# Altium project MAIN_BORAD.PrjPcb
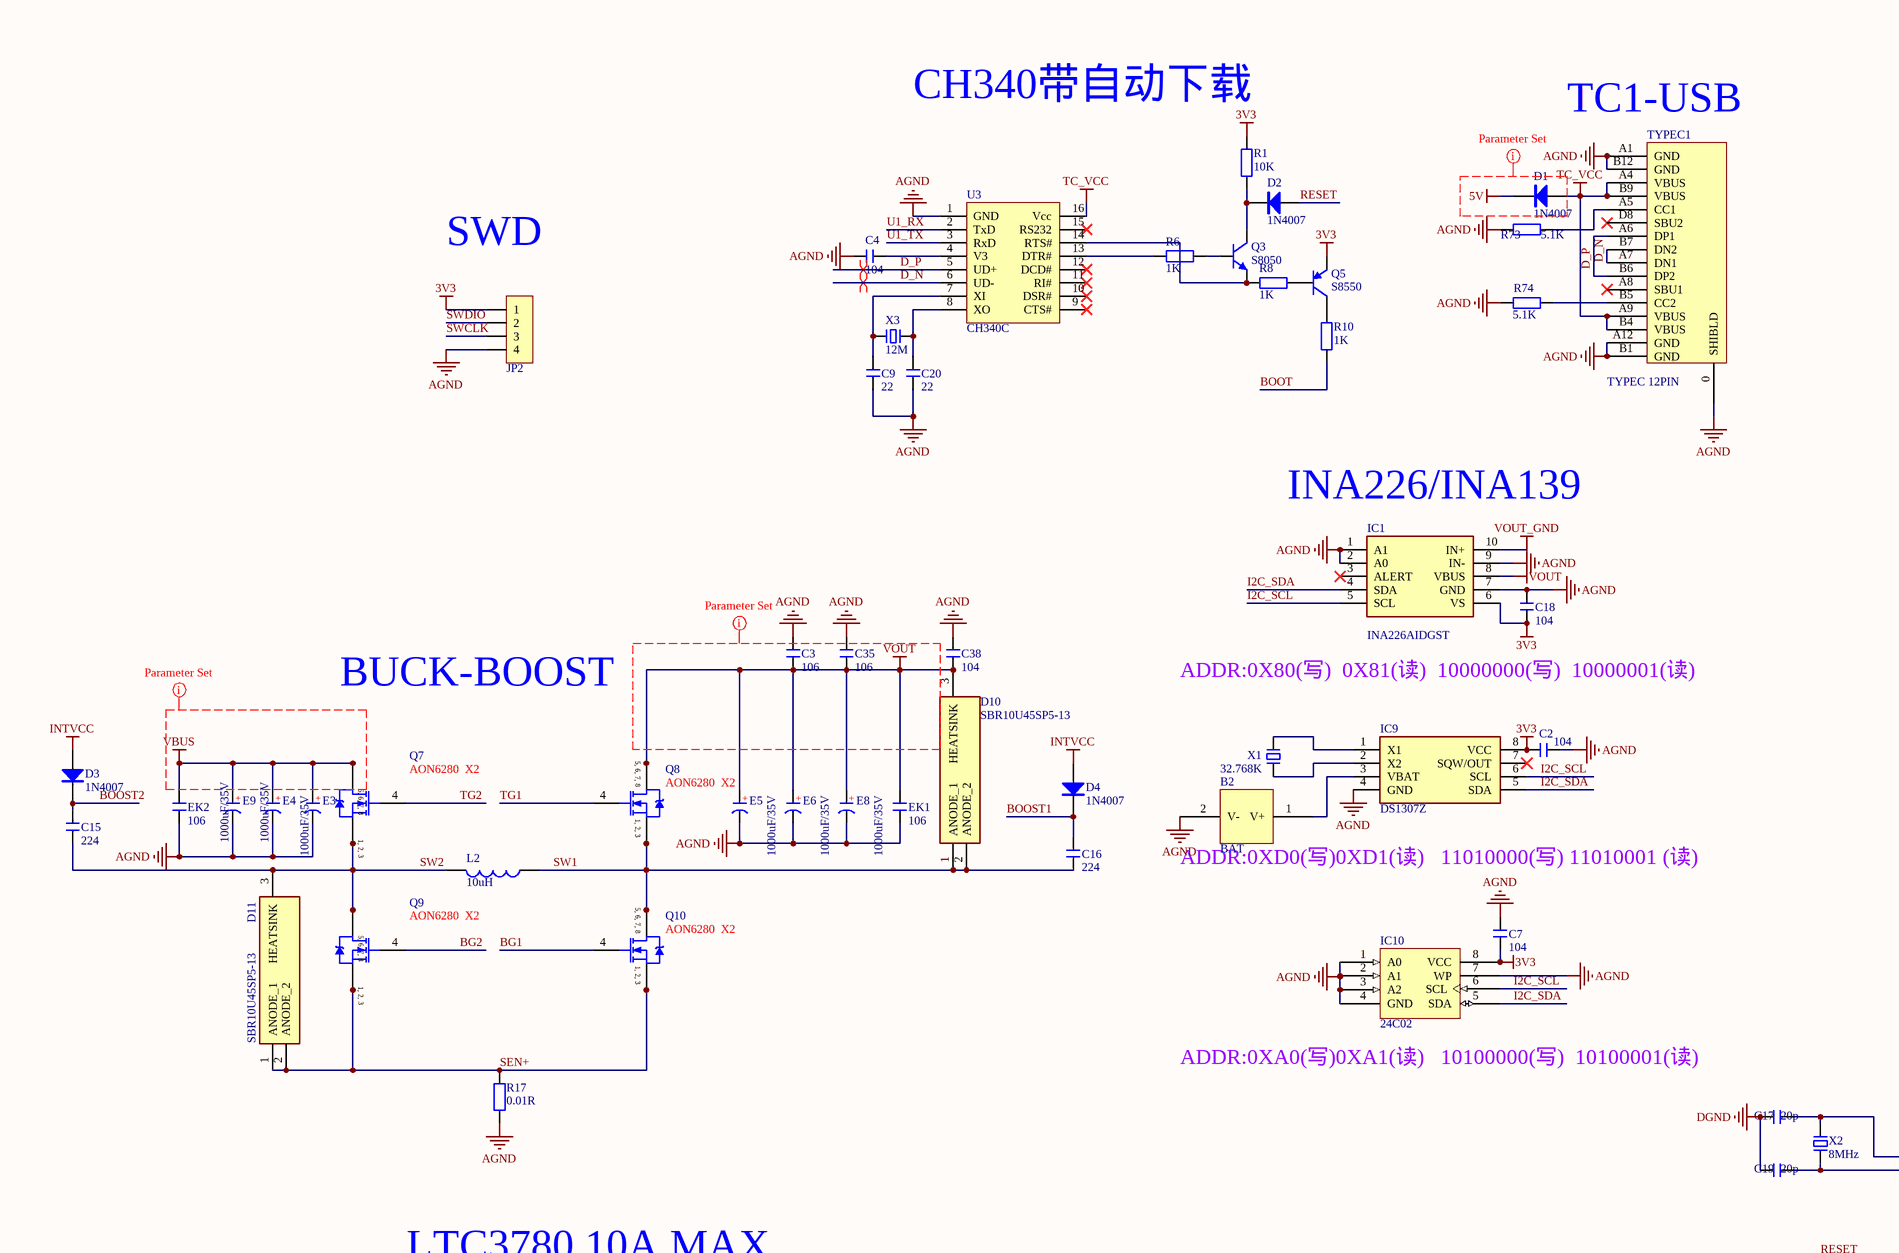
[diagram p0: MAIN_BORAD.SchDoc, top left]
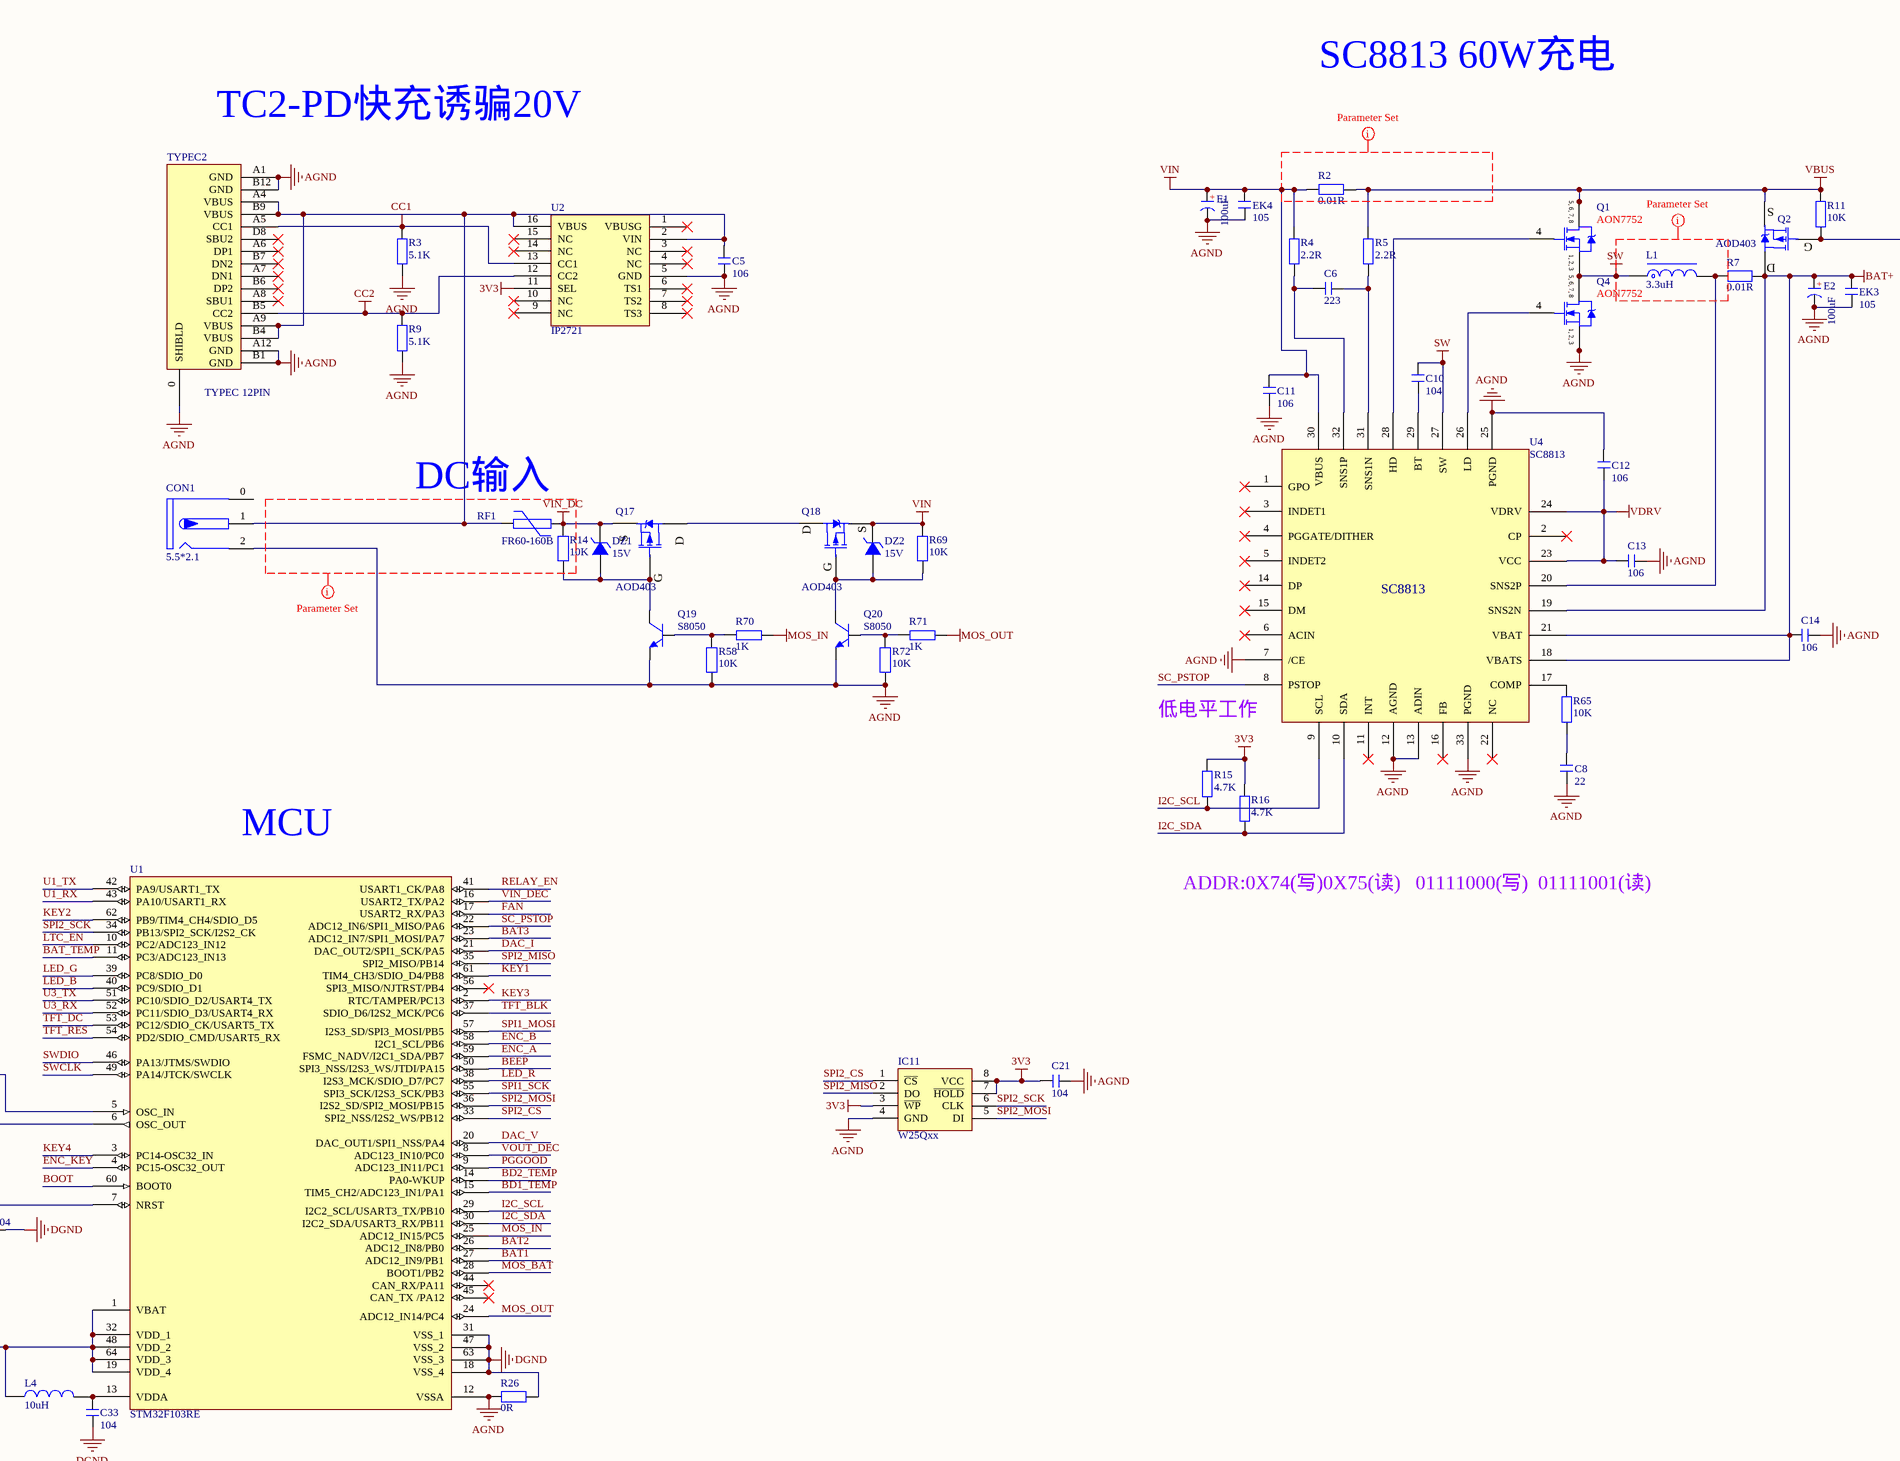
[diagram p1: MAIN_BORAD.SchDoc, top middle]
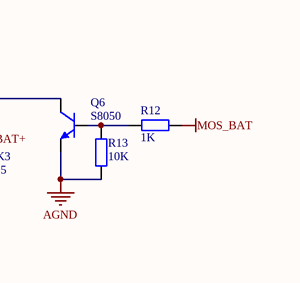
[diagram p2: MAIN_BORAD.SchDoc, top right]
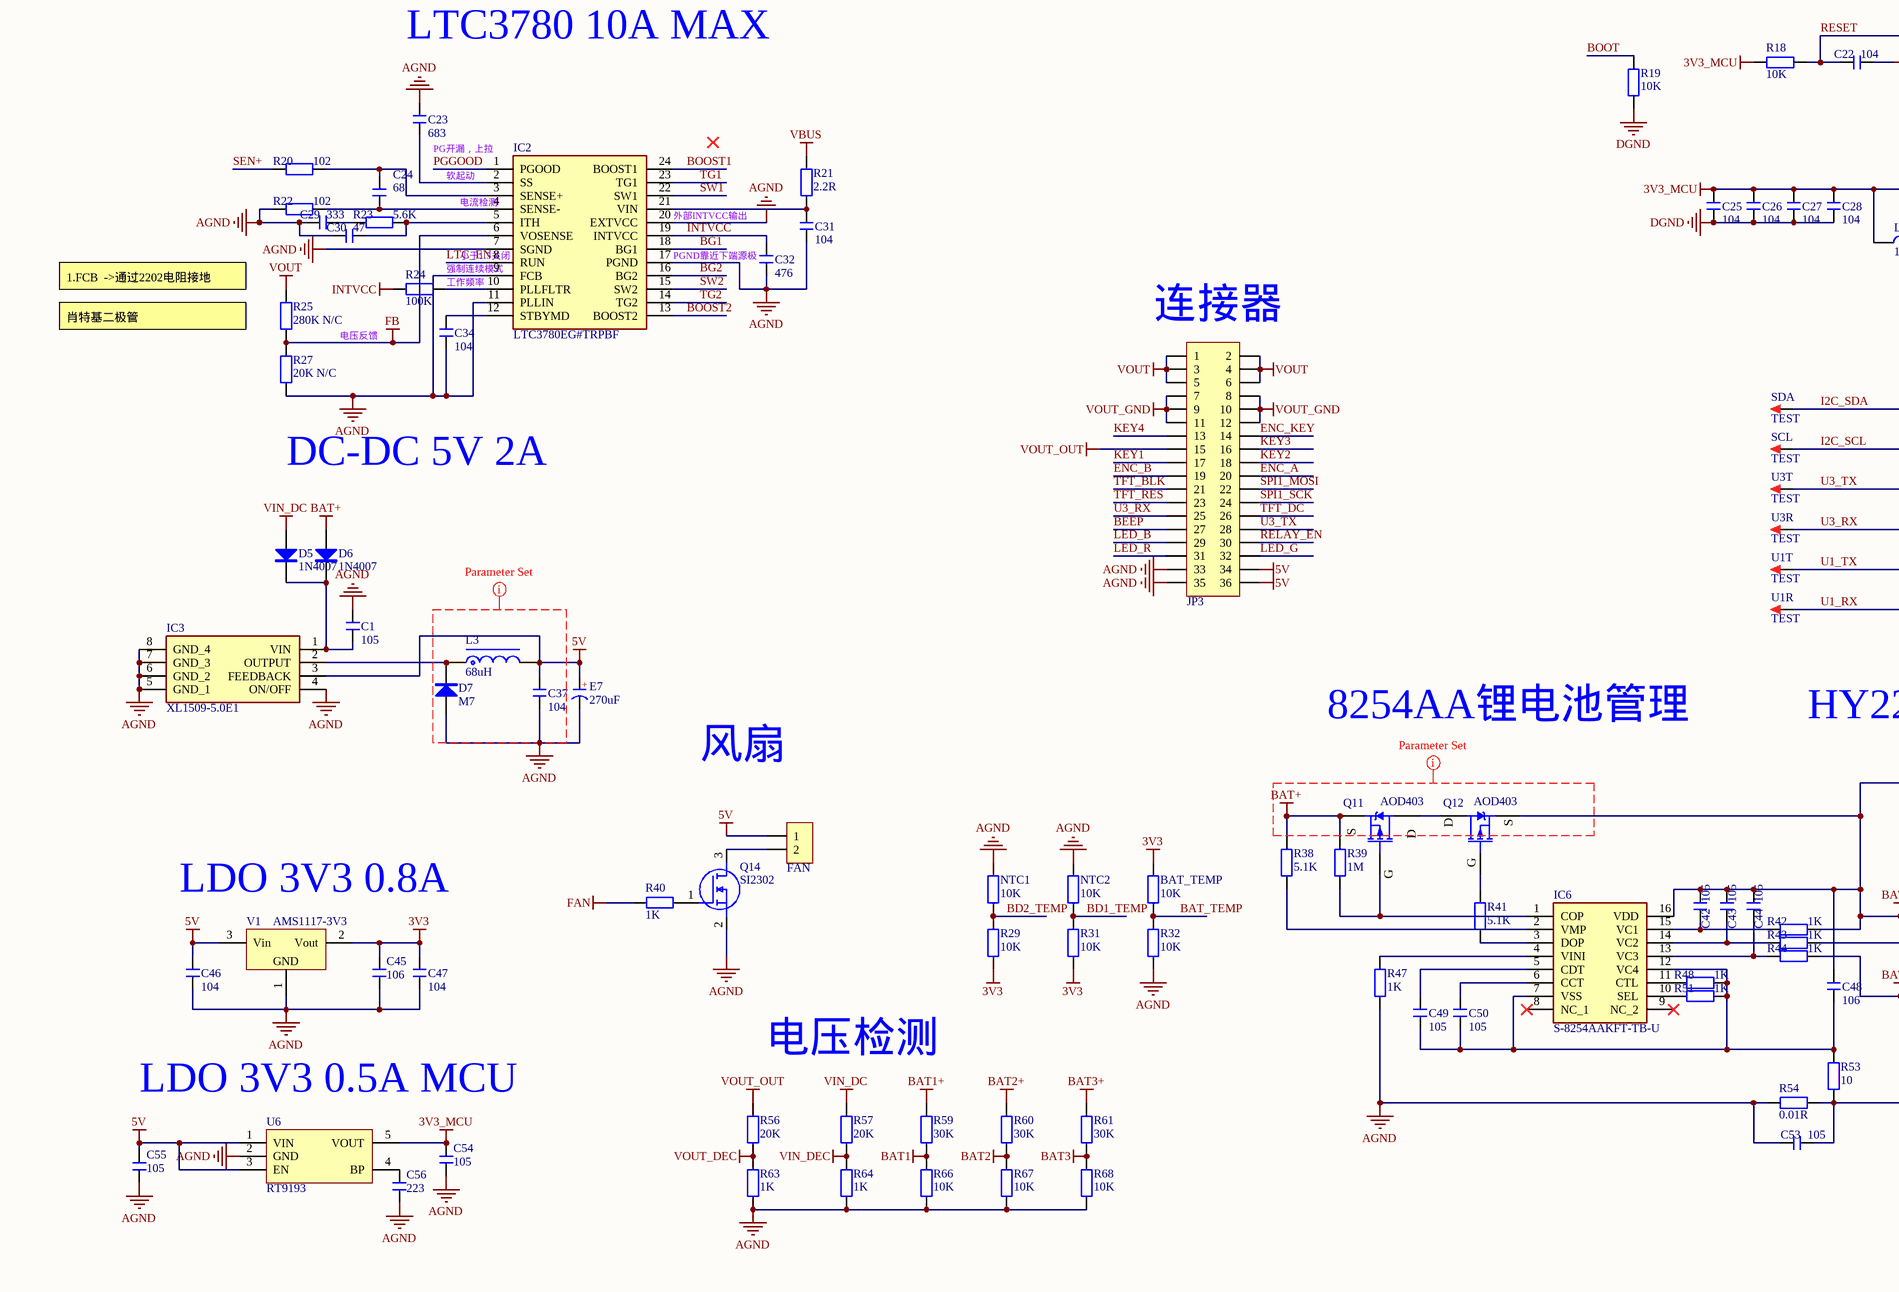
[diagram p3: MAIN_BORAD.SchDoc, bottom left]
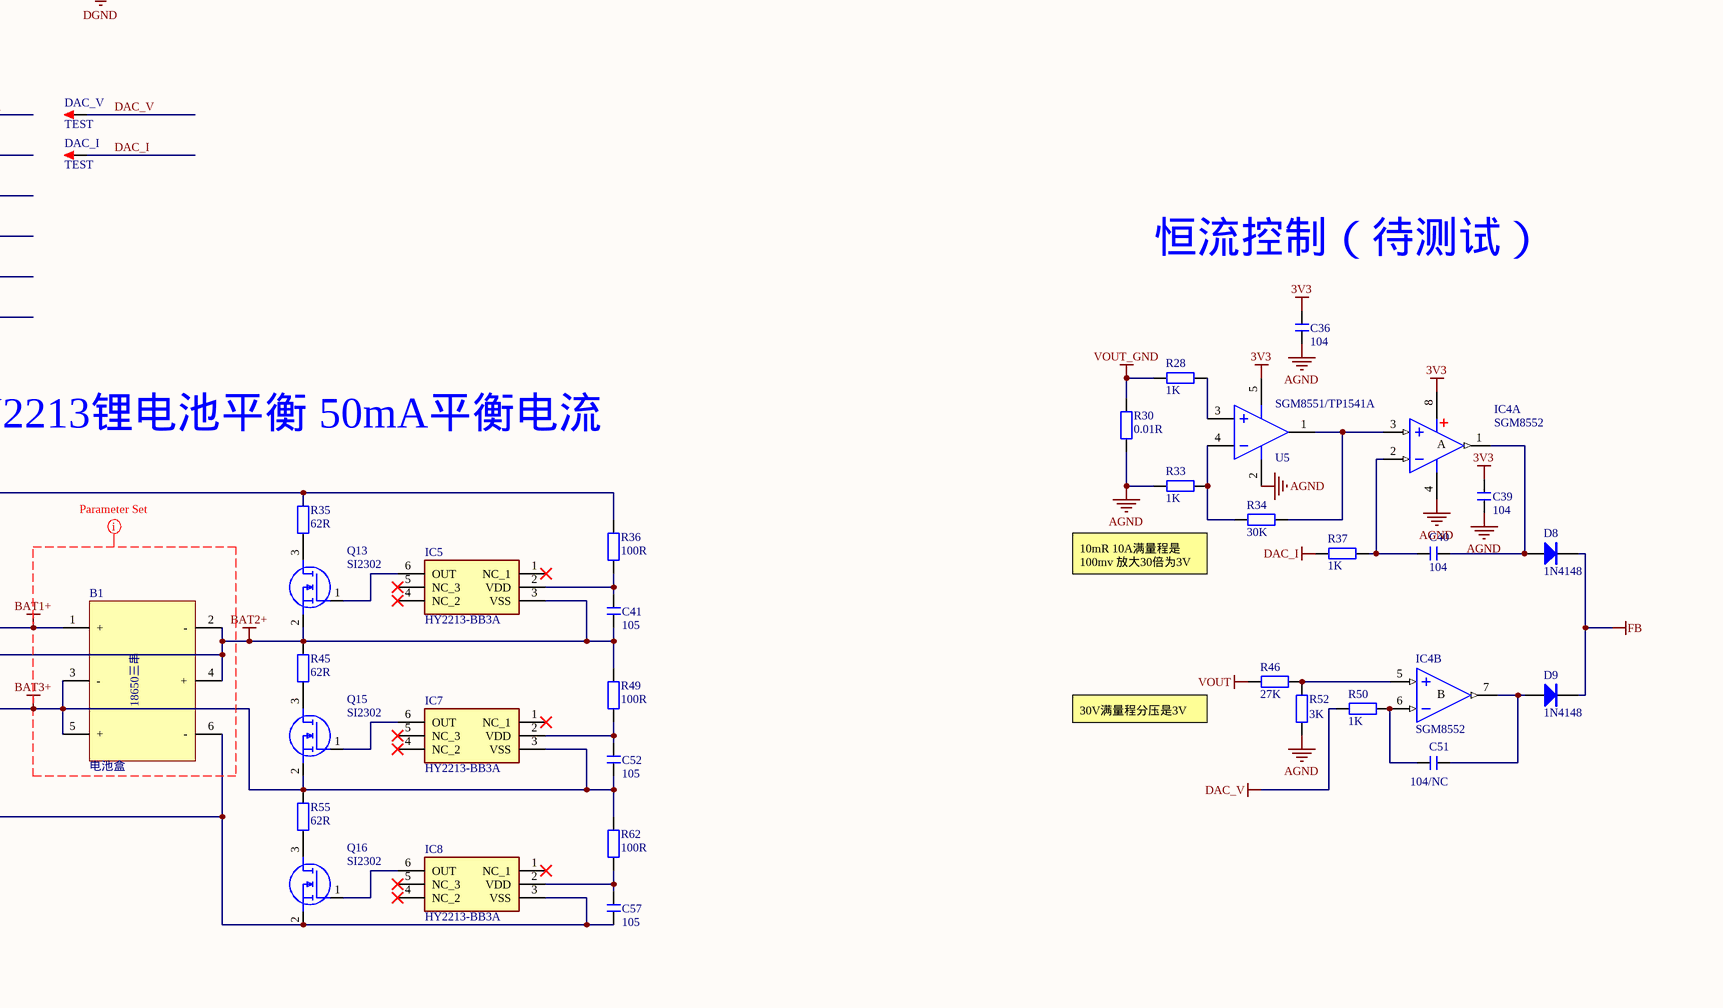
[diagram p4: MAIN_BORAD.SchDoc, bottom middle]
1 sheet, 222 parts. Net scope: global (net labels, ports and power ports of the same name join across sheets).
Board file: MAIN_BORAD.PcbDoc

## Sheet MAIN_BORAD.SchDoc
size A1; Organization: Protel International P/L; Address1: L3, 12a Rodborough Rd; Address2: Frenchs Forest; Address3: NSW; Address4: Australia 2086

### Parts
B1  电池盒  [18650]
B2  BAT  [bat]
BAT_TEMP  10K  [R 0603_M]
C1  105  [C 0603_M]
C2  104  [C 0603_M]
C3  106  [C 0805_M]
C4  104  [C 0603_M]
C5  106  [C 0603_M]
C6  223  [C 0603_M]
C7  104  [C 0603_M]
C8  22  [C 0603_M]
C9  22  [C 0603_M]
C10  104  [C 0603_M]
C11  106  [C 0603_M]
C12  106  [C 0603_M]
C13  106  [C 0603_M]
C14  106  [C 0603_M]
C15  224  [C 0603_M]
C16  224  [C 0603_M]
C17  20p  [C 0603_M]
C18  104  [C 0603_M]
C19  20p  [C 0603_M]
C20  22  [C 0603_M]
C21  104  [C 0603_M]
C22  104  [C 0603_M]
C23  683  [C 0603_M]
C24  68  [C 0603_M]
C25  104  [C 0603_M]
C26  104  [C 0603_M]
C27  104  [C 0603_M]
C28  104  [C 0603_M]
C29  333  [C 0603_M]
C30  47  [C 0603_M]
C31  104  [C 0603_M]
C32  476  [C 0603_M]
C33  104  [C 0603_M]
C34  104  [C 0603_M]
C35  106  [C 0805_M]
C36  104  [C 0603_M]
C37  104  [C 0603_M]
C38  104  [C 0805_M]
C39  104  [C 0603_M]
C40  104  [C 0603_M]
C41  105  [C 0603_M]
C42  105  [C 0603_M]
C43  105  [C 0603_M]
C44  105  [C 0603_M]
C45  106  [C 0603_M]
C46  104  [C 0603_M]
C47  104  [C 0603_M]
C48  106  [C 0603_M]
C49  105  [C 0603_M]
C50  105  [C 0603_M]
C51  104/NC  [C 0603_M]
C52  105  [C 0603_M]
C53  105  [C 0603_M]
C54  105  [C 0603_M]
C55  105  [C 0603_M]
C56  223  [C 0603_M]
C57  105  [C 0603_M]
CON1  5.5*2.1  [DC-005P]
D1  1N4007  [SOD-123]
D2  1N4007  [SOD-123]
D3  1N4007  [SOD-123]
D4  1N4007  [SOD-123]
D5  1N4007  [SOD-123]
D6  1N4007  [SOD-123]
D7  M7  [SMA]
D8  1N4148  [SOD-323]
D9  1N4148  [SOD-323]
D10  SBR10U45SP5-13  [PDS104013]
D11  SBR10U45SP5-13  [PDS104013]
DAC_I  TEST  [TEST 1]
DAC_V  TEST  [TEST 1]
DZ1  15V  [DO-213AA]
DZ2  15V  [DO-213AA]
E1  100uF  [CAP 2.0*5*11 - GD]
E2  100uF  [CAP 2.5*5*11 - GD]
E3  1000uF/35V  [CAP 5.0*10*20 - GD]
E4  1000uF/35V  [CAP 5.0*10*20 - GD]
E5  1000uF/35V  [CAP 5.0*10*20 - GD]
E6  1000uF/35V  [CAP 5.0*10*20 - GD]
E7  270uF  [CAP 2.0*5*11 - GD]
E8  1000uF/35V  [CAP 5.0*10*20 - GD]
E9  1000uF/35V  [CAP 5.0*10*20 - GD]
EK1  106  [C 1210_M]
EK2  106  [C 1210_M]
EK3  105  [C 1206_M]
EK4  105  [C 1206_M]
FAN  HDR-1X2  [XH2.54-LI-2P]  (value not drawn)
IC1  INA226AIDGST  [SOP50P490X110-10N]
IC2  LTC3780EG#TRPBF  [SOP65P780X200-24N]
IC3  XL1509-5.0E1  [SOIC127P600X175-8N]
IC4  SGM8552  [SOP8_M]  (parts A,B of 2)
IC5  HY2213-BB3A  [SOT95P280X140-6N]
IC6  S-8254AAKFT-TB-U  [SOP65P640X110-16N]
IC7  HY2213-BB3A  [SOT95P280X140-6N]
IC8  HY2213-BB3A  [SOT95P280X140-6N]
IC9  DS1307Z  [SOP8_M]
IC10  24C02  [SOP8_M]
IC11  W25Qxx  [SOP8W_N]
JP2  HDR-1X4  [ZH1.5-WS-4P]  (value not drawn)
JP3  Header 2X11  [HDR2.54-WI-2x18P]  (value not drawn)
L1  3.3uH  [CDRH125]
L2  10uH  [SER2010202MLD]
L3  68uH  [CDRH74]
L4  10uH  [L 0805]
NTC1  10K  [R 0603_M]
NTC2  10K  [R 0603_M]
Q1  AON7752  [EMB20N03V]
Q2  AOD403  [TO252]
Q3  S8050  [SOT23-3M]
Q4  AON7752  [EMB20N03V]
Q5  S8550  [SOT23-3M]
Q6  S8050  [SOT23-3M]
Q7  AON6280  X2  [TPH1R306PLL1Q]
Q8  AON6280  X2  [TPH1R306PLL1Q]
Q9  AON6280  X2  [TPH1R306PLL1Q]
Q10  AON6280  X2  [TPH1R306PLL1Q]
Q11  AOD403  [TO252]
Q12  AOD403  [TO252]
Q13  SI2302  [SOT23-3M]
Q14  SI2302  [SI2302]
Q15  SI2302  [SOT23-3M]
Q16  SI2302  [SOT23-3M]
Q17  AOD403  [TO252]
Q18  AOD403  [TO252]
Q19  S8050  [SOT23-3M]
Q20  S8050  [SOT23-3M]
R1  10K  [R 0603_M]
R2  0.01R  [R 2512_M]
R3  5.1K  [R 0603_M]
R4  2.2R  [R 0603_M]
R5  2.2R  [R 0603_M]
R6  1K  [R 0603_M]
R7  0.01R  [R 1210_M]
R8  1K  [R 0603_M]
R9  5.1K  [R 0603_M]
R10  1K  [R 0603_M]
R11  10K  [R 0603_M]
R12  1K  [R 0603_M]
R13  10K  [R 0603_M]
R14  10K  [R 0603_M]
R15  4.7K  [R 0603_M]
R16  4.7K  [R 0603_M]
R17  0.01R  [R 1210_M]
R18  10K  [R 0603_M]
R19  10K  [R 0603_M]
R20  102  [R 0603_M]
R21  2.2R  [R 0603_M]
R22  102  [R 0603_M]
R23  5.6K  [R 0603_M]
R24  100K  [R 0603_M]
R25  280K N/C  [R 0603_M]
R26  0R  [R 0603_M]
R27  20K N/C  [R 0603_M]
R28  1K  [R 0603_M]
R29  10K  [R 0603_M]
R30  0.01R  [R 2512_M]
R31  10K  [R 0603_M]
R32  10K  [R 0603_M]
R33  1K  [R 0603_M]
R34  30K  [R 0603_M]
R35  62R  [R 0805_M]
R36  100R  [R 0603_M]
R37  1K  [R 0603_M]
R38  5.1K  [R 0603_M]
R39  1M  [R 0603_M]
R40  1K  [R 0603_M]
R41  5.1K  [R 0603_M]
R42  1K  [R 0603_M]
R43  1K  [R 0603_M]
R44  1K  [R 0603_M]
R45  62R  [R 0805_M]
R46  27K  [R 0603_M]
R47  1K  [R 0603_M]
R48  1K  [R 0603_M]
R49  100R  [R 0603_M]
R50  1K  [R 0603_M]
R51  1K  [R 0603_M]
R52  3K  [R 0603_M]
R53  10  [R 0603_M]
R54  0.01R  [R 2512_M]
R55  62R  [R 0805_M]
R56  20K  [R 0603_M]
R57  20K  [R 0603_M]
R58  10K  [R 0603_M]
R59  30K  [R 0603_M]
R60  30K  [R 0603_M]
R61  30K  [R 0603_M]
R62  100R  [R 0603_M]
R63  1K  [R 0603_M]
R64  1K  [R 0603_M]
R65  10K  [R 0603_M]
R66  10K  [R 0603_M]
R67  10K  [R 0603_M]
R68  10K  [R 0603_M]
R69  10K  [R 0603_M]
R70  1K  [R 0603_M]
R71  1K  [R 0603_M]
R72  10K  [R 0603_M]
R73  5.1K  [R 0603_M]
R74  5.1K  [R 0603_M]
RF1  FR60-160B  [FR60-160B]
SCL  TEST  [TEST 1]
SDA  TEST  [TEST 1]
TYPEC1  TYPEC 12PIN  [TYPEC_16P]
TYPEC2  TYPEC 12PIN  [TYPEC_16P]
U1  STM32F103RE  [LQFP64 10X10_L]
U1R  TEST  [TEST 1]
U1T  TEST  [TEST 1]
U2  IP2721  [TSSOP16_M]
U3  CH340C  [SOP16_M]
U3R  TEST  [TEST 1]
U3T  TEST  [TEST 1]
U4  SC8813  [QFN40P400X400X80_HS-33N]
U5  SGM8551/TP1541A  [SOT23-5M]
U6  RT9193  [SOT23-5M]
V1  AMS1117-3V3  [SOT223_M]
X1  32.768K  [OSC-3x10-WS]
X2  8MHz  [OSC 5032-2P]
X3  12M  [OSC 3215-2P]

### Nets
3V3: BAT_TEMP.1 C2.2 C7.2 C18.2 C21.1 C36.1 C39.1 C45.2 C47.2 IC1.6(VS) IC4.8(V+) IC9.8(VCC) IC10.8(VCC) IC11.3(~{WP}) IC11.7(~{HOLD}) IC11.8(VCC) JP2.1 Q5.2(E) R1.2 R15.2 R16.2 R29.2 R31.2 U2.11(SEL) U5.5(V+) V1.2(Vout)
3V3_MCU: C25.2 C26.2 C27.2 C28.2 C54.2 L4.1 R18.1 U1.1(VBAT) U1.19(VDD_4) U1.32(VDD_1) U1.48(VDD_2) U1.64(VDD_3) U6.5(VOUT)
5V: C37.1 C46.2 C55.2 D1.2(K) E7.1(A) FAN.1 IC3.3(FEEDBACK) JP3.34 JP3.36 L3.2 U6.1(VIN) U6.3(EN) V1.3(Vin)
AGND: B2.2(V-) C1.1 C2.1 C3.2 C4.1 C5.1 C7.1 C8.2 C9.1 C11.2 C12.1 C13.1 C14.1 C18.1 C20.1 C21.2 C23.1 C29.2 C30.2 C31.2 C32.1 C34.2 C35.2 C36.2 C37.2 C38.2 C39.2 C45.1 C46.1 C47.1 C53.1 C54.1 C55.1 C56.1 CON1.2 D7.1(A) E1.2(K) E2.2(K) E3.2(K) E4.2(K) E5.2(K) E6.2(K) E7.2(K) E8.2(K) E9.2(K) EK1.1 EK2.1 EK3.2 EK4.2 IC1.1(A1) IC1.2(A0) IC1.7(GND) IC1.9(IN-) IC2.7(SGND) IC2.9(FCB) IC2.11(PLLIN) IC2.17(PGND) IC2.20(EXTVCC) IC3.4(ON/OFF) IC3.5(GND_1) IC3.6(GND_2) IC3.7(GND_3) IC3.8(GND_4) IC4.4(V-) IC9.4(GND) IC10.1(A0) IC10.2(A1) IC10.3(A2) IC10.4(GND) IC10.7(WP) IC11.4(GND) JP2.4 JP3.33 JP3.35 NTC1.1 NTC2.1 Q4.1(S) Q4.2(S) Q4.3(S) Q6.2(E) Q14.2(S) Q19.2(E) Q20.2(E) R3.2 R9.2 R13.1 R17.1 R22.2 R26.1 R27.1 R30.1 R32.2 R33.1 R47.1 R52.1 R54.2 R58.1 R63.2 R64.2 R66.2 R67.2 R68.2 R72.1 R73.2 R74.1 TYPEC1.0(SHIBLD) TYPEC1.A1(GND) TYPEC1.A12(GND) TYPEC1.B1(GND) TYPEC1.B12(GND) TYPEC2.0(SHIBLD) TYPEC2.A1(GND) TYPEC2.A12(GND) TYPEC2.B1(GND) TYPEC2.B12(GND) U1.12(VSSA) U2.5(GND) U3.1(GND) U4.7(/CE) U4.12(AGND) U4.13(ADIN) U4.25(PGND) U4.33(PGND) U5.2(V-) U6.2(GND) V1.1(GND)
BAT1: R59.2 R66.1 U1.27(ADC12_IN9/PB1)
BAT1+: B1.1(+) C42.1 C43.1 C44.1 C48.1 IC6.16(VDD) Q12.3(S) R35.1 R36.1 R42.1 R59.1
BAT2: R60.2 R67.1 U1.26(ADC12_IN8/PB0)
BAT2+: B1.2(-) B1.4(+) C41.1 IC5.3(VSS) Q13.2(S) R43.1 R45.1 R49.1 R60.1
BAT3: R61.2 R68.1 U1.23(ADC12_IN7/SPI1_MOSI/PA7)
BAT3+: B1.3(-) B1.5(+) C52.1 IC7.3(VSS) Q15.2(S) R44.1 R55.1 R61.1 R62.1
BAT+: C14.2 D6.1(A) E2.1(A) EK3.1 Q2.2(D) Q11.3(S) R7.2 R38.1 R39.1 U4.18(VBATS) U4.19(SNS2N) U4.21(VBAT)
CC1: R3.1 TYPEC2.A5(CC1) U2.13(CC1)
CC2: R9.1 TYPEC2.B5(CC2) U2.12(CC2)
DAC_I: DAC_I.1 R37.1 U1.21(DAC_OUT2/SPI1_SCK/PA5)
DAC_V: DAC_V.1 R50.1 U1.20(DAC_OUT1/SPI1_NSS/PA4)
DGND: C17.1 C19.2 C22.1 C25.1 C26.1 C27.1 C28.1 C33.1 R19.1 R26.2 U1.18(VSS_4) U1.31(VSS_1) U1.47(VSS_2) U1.63(VSS_3)
FAN: R40.2 U1.17(USART2_RX/PA3)
FB: D8.2(K) D9.2(K) IC2.6(VOSENSE) R25.1 R27.2
INTVCC: C32.2 D3.1(A) D4.1(A) IC2.19(INTVCC) R24.2
MOS_BAT: R12.1 U1.28(BOOT1/PB2)
MOS_IN: R70.1 U1.25(ADC12_IN15/PC5)
MOS_OUT: R71.1 U1.24(ADC12_IN14/PC4)
SW: C10.1 L1.1 Q1.1(S) Q1.2(S) Q1.3(S) Q4.5(D) Q4.6(D) Q4.7(D) Q4.8(D) U4.27(SW)
TC_VCC: D1.1(A) TYPEC1.A4(VBUS) TYPEC1.A9(VBUS) TYPEC1.B4(VBUS) TYPEC1.B9(VBUS) U3.16(Vcc)
VBUS: E3.1(A) E4.1(A) E9.1(A) EK2.2 Q1.5(D) Q1.6(D) Q1.7(D) Q1.8(D) Q2.3(S) Q7.5(D) Q7.6(D) Q7.7(D) Q7.8(D) R2.2 R5.2 R11.1 R21.1
VDRV: C12.2 C13.2 U4.23(VCC) U4.24(VDRV)
VIN: C11.1 DZ2.2(K) E1.1(A) EK4.1 Q18.3(S) R2.1 R4.2 R69.2 U4.30(VBUS)
VIN_DC: D5.1(A) DZ1.2(K) Q17.3(S) R14.2 R57.1 RF1.1
VIN_DEC: R57.2 R64.1 U1.16(USART2_TX/PA2)
VOUT: C3.1 C35.1 C38.1 D10.3(HEATSINK) E5.1(A) E6.1(A) E8.1(A) EK1.2 IC1.8(VBUS) JP3.1 JP3.2 JP3.3 JP3.4 JP3.5 JP3.6 Q8.5(D) Q8.6(D) Q8.7(D) Q8.8(D) R25.2 R46.2
VOUT_DEC: R56.2 R63.1 U1.8(ADC123_IN10/PC0)
VOUT_GND: IC1.10(IN+) JP3.7 JP3.8 JP3.9 JP3.10 JP3.11 JP3.12 R28.1 R30.2
VOUT_OUT: JP3.15 R56.1
BAT_TEMP: BAT_TEMP.2 R32.1 U1.11(PC3/ADC123_IN13)
BD1_TEMP: NTC2.2 R31.1 U1.15(TIM5_CH2/ADC123_IN1/PA1)
BD2_TEMP: NTC1.2 R29.1 U1.14(PA0-WKUP)
BEEP: JP3.27 U1.50(SPI3_NSS/I2S3_WS/JTDI/PA15)
BG1: IC2.18(BG1) Q10.4(G)
BG2: IC2.16(BG2) Q9.4(G)
BOOST1: C16.2 D4.2(K) IC2.24(BOOST1)
BOOST2: C15.2 D3.2(K) IC2.13(BOOST2)
BOOT: R10.2 R19.2 U1.60(BOOT0)
D_N: TYPEC1.A7(DN1) TYPEC1.B7(DN2) U3.6(UD-)
D_P: TYPEC1.A6(DP1) TYPEC1.B6(DP2) U3.5(UD+)
ENC_A: JP3.20 U1.59(FSMC_NADV/I2C1_SDA/PB7)
ENC_B: JP3.19 U1.58(I2C1_SCL/PB6)
ENC_KEY: JP3.14 U1.4(PC15-OSC32_OUT)
I2C_SCL: IC1.5(SCL) IC9.6(SCL) IC10.6(SCL) R15.1 SCL.1 U1.29(I2C2_SCL/USART3_TX/PB10) U4.9(SCL)
I2C_SDA: IC1.4(SDA) IC9.5(SDA) IC10.5(SDA) R16.1 SDA.1 U1.30(I2C2_SDA/USART3_RX/PB11) U4.10(SDA)
KEY1: JP3.17 U1.61(TIM4_CH3/SDIO_D4/PB8)
KEY2: JP3.18 U1.62(PB9/TIM4_CH4/SDIO_D5)
KEY3: JP3.16 U1.2(RTC/TAMPER/PC13)
KEY4: JP3.13 U1.3(PC14-OSC32_IN)
LED_B: JP3.29 U1.40(PC9/SDIO_D1)
LED_G: JP3.32 U1.39(PC8/SDIO_D0)
LED_R: JP3.31 U1.38(I2S3_MCK/SDIO_D7/PC7)
LTC_EN: IC2.8(RUN) U1.10(PC2/ADC123_IN12)
PGGOOD: IC2.1(PGOOD) U1.9(ADC123_IN11/PC1)
RELAY_EN: JP3.30 U1.41(USART1_CK/PA8)
RESET: C22.2 D2.1(A) R18.2 U1.7(NRST)
SC_PSTOP: U1.22(ADC12_IN6/SPI1_MISO/PA6) U4.8(PSTOP)
SEN+: D11.1(ANODE_1) D11.2(ANODE_2) Q9.1(S) Q9.2(S) Q9.3(S) Q10.1(S) Q10.2(S) Q10.3(S) R17.2 R20.2
SPI1_MOSI: JP3.22 U1.57(I2S3_SD/SPI3_MOSI/PB5)
SPI1_SCK: JP3.24 U1.55(SPI3_SCK/I2S3_SCK/PB3)
SPI2_CS: IC11.1(~{CS}) U1.33(SPI2_NSS/I2S2_WS/PB12)
SPI2_MISO: IC11.2(DO) U1.35(SPI2_MISO/PB14)
SPI2_MOSI: IC11.5(DI) U1.36(I2S2_SD/SPI2_MOSI/PB15)
SPI2_SCK: IC11.6(CLK) U1.34(PB13/SPI2_SCK/I2S2_CK)
SW1: C16.1 D10.1(ANODE_1) D10.2(ANODE_2) IC2.22(SW1) L2.1 Q8.1(S) Q8.2(S) Q8.3(S) Q10.5(D) Q10.6(D) Q10.7(D) Q10.8(D)
SW2: C15.1 D11.3(HEATSINK) IC2.15(SW2) L2.2 Q7.1(S) Q7.2(S) Q7.3(S) Q9.5(D) Q9.6(D) Q9.7(D) Q9.8(D)
SWCLK: JP2.3 U1.49(PA14/JTCK/SWCLK)
SWDIO: JP2.2 U1.46(PA13/JTMS/SWDIO)
TFT_BLK: JP3.21 U1.37(SDIO_D6/I2S2_MCK/PC6)
TFT_DC: JP3.26 U1.53(PC12/SDIO_CK/USART5_TX)
TFT_RES: JP3.23 U1.54(PD2/SDIO_CMD/USART5_RX)
TG1: IC2.23(TG1) Q8.4(G)
TG2: IC2.14(TG2) Q7.4(G)
U1_RX: U1.43(PA10/USART1_RX) U1R.1 U3.2(TxD)
U1_TX: U1.42(PA9/USART1_TX) U1T.1 U3.3(RxD)
U3_RX: JP3.25 U1.52(PC11/SDIO_D3/USART4_RX) U3R.1
U3_TX: JP3.28 U1.51(PC10/SDIO_D2/USART4_TX) U3T.1
NetB1_6: B1.6(-) C53.2 C57.1 IC8.3(VSS) Q16.2(S) R53.2 R54.1
NetB2_1: B2.1(V+) IC9.3(VBAT)
NetC1_2: C1.2 D5.2(K) D6.2(K) IC3.1(VIN)
NetC4_2: C4.2 U3.4(V3)
NetC5_2: C5.2 CON1.1 RF1.2 TYPEC2.A4(VBUS) TYPEC2.A9(VBUS) TYPEC2.B4(VBUS) TYPEC2.B9(VBUS) U2.2(VIN) U2.16(VBUS)
NetC6_1: C6.1 R4.1 U4.32(SNS1P)
NetC6_2: C6.2 R5.1 U4.31(SNS1N)
NetC8_1: C8.1 R65.1
NetC9_2: C9.2 U3.7(XI) X3.1
NetC10_2: C10.2 U4.29(BT)
NetC17_2: C17.2 U1.5(OSC_IN) X2.1
NetC19_1: C19.1 U1.6(OSC_OUT) X2.2
NetC20_2: C20.2 U3.8(XO) X3.2
NetC23_2: C23.2 IC2.2(SS)
NetC24_1: C24.1 IC2.4(SENSE-) R22.1
NetC24_2: C24.2 IC2.3(SENSE+) R20.1
NetC29_1: C29.1 R23.2
NetC30_1: C30.1 IC2.5(ITH) R23.1
NetC31_1: C31.1 IC2.21(VIN) R21.2
NetC33_2: C33.2 L4.2 U1.13(VDDA)
NetC34_1: C34.1 IC2.12(STBYMD)
NetC40_1: C40.1 D8.1(A) IC4.1(OUT)
NetC40_2: C40.2 IC4.2(IN-) R37.2
NetC41_2: C41.2 IC5.2(VDD) R36.2
NetC42_2: C42.2 IC6.15(VC1) R42.2
NetC43_2: C43.2 IC6.14(VC2) R43.2
NetC44_2: C44.2 IC6.13(VC3) R44.2
NetC48_2: C48.2 C49.2 C50.2 IC6.7(VSS) IC6.12(VC4) R48.1 R51.1 R53.1
NetC49_1: C49.1 IC6.5(CDT)
NetC50_1: C50.1 IC6.6(CCT)
NetC51_1: C51.1 D9.1(A) IC4.7(OUT)
NetC51_2: C51.2 IC4.6(IN-) R50.2
NetC52_2: C52.2 IC7.2(VDD) R49.2
NetC56_2: C56.2 U6.4(BP)
NetC57_2: C57.2 IC8.2(VDD) R62.2
NetD2_2: D2.2(K) Q3.3(C) R1.1
NetD7_2: D7.2(K) IC3.2(OUTPUT) L3.1
NetDZ1_1: DZ1.1(A) Q17.1(G) Q19.3(C) R14.1
NetDZ2_1: DZ2.1(A) Q18.1(G) Q20.3(C) R69.1
NetFAN_2: FAN.2 Q14.3(D)
NetIC2_10: IC2.10(PLLFLTR) R24.1
NetIC4_3: IC4.3(IN+) R34.2 U5.1(OUT)
NetIC4_5: IC4.5(IN+) R46.1 R52.2
NetIC5_6: IC5.6(OUT) Q13.1(G)
NetIC6_1: IC6.1(COP) Q11.1(G) R39.2
NetIC6_2: IC6.2(VMP) R38.2
NetIC6_3: IC6.3(DOP) R41.1
NetIC6_4: IC6.4(VINI) R47.2
NetIC6_10: IC6.10(SEL) R51.2
NetIC6_11: IC6.11(CTL) R48.2
NetIC7_6: IC7.6(OUT) Q15.1(G)
NetIC8_6: IC8.6(OUT) Q16.1(G)
NetIC9_1: IC9.1(X1) X1.1
NetIC9_2: IC9.2(X2) X1.2
NetL1_2: L1.2 R7.1 U4.20(SNS2P)
NetQ1_4: Q1.4(G) U4.28(HD)
NetQ2_1: Q2.1(G) Q6.3(C) R11.2
NetQ3_1: Q3.1(B) R6.2
NetQ3_2: Q3.2(E) R8.1 U3.14(RTS#)
NetQ4_4: Q4.4(G) U4.26(LD)
NetQ5_1: Q5.1(B) R8.2
NetQ5_3: Q5.3(C) R10.1
NetQ6_1: Q6.1(B) R12.2 R13.2
NetQ11_2: Q11.2(D) Q12.2(D)
NetQ12_1: Q12.1(G) R41.2
NetQ13_3: Q13.3(D) R35.2
NetQ14_1: Q14.1(G) R40.1
NetQ15_3: Q15.3(D) R45.2
NetQ16_3: Q16.3(D) R55.2
NetQ17_2: Q17.2(D) Q18.2(D)
NetQ19_1: Q19.1(B) R58.2 R70.2
NetQ20_1: Q20.1(B) R71.2 R72.2
NetR6_1: R6.1 U3.13(DTR#)
NetR28_2: R28.2 U5.3(+)
NetR33_2: R33.2 R34.1 U5.4(IN-)
NetR65_2: R65.2 U4.17(COMP)
NetR73_1: R73.1 TYPEC1.A5(CC1)
NetR74_2: R74.2 TYPEC1.B5(CC2)

Not connected (* = marked no-connect by the designer): CON1 0; IC1 3(ALERT)*; IC5 1(NC_1)* 4(NC_2)* 5(NC_3)*; IC6 8(NC_1)* 9(NC_2)*; IC7 1(NC_1)* 4(NC_2)* 5(NC_3)*; IC8 1(NC_1)* 4(NC_2)* 5(NC_3)*; IC9 7(SQW/OUT)*; TYPEC1 A8(SBU1)* D8(SBU2)*; TYPEC2 A6(DP1)* A7(DN1)* A8(SBU1)* B6(DP2)* B7(DN2)* D8(SBU2)*; U1 44(CAN_RX/PA11)* 45(CAN_TX_/PA12)* 56(SPI3_MISO/NJTRST/PB4)*; U2 1(VBUSG)* 3(NC)* 4(NC)* 6(TS1)* 7(TS2)* 8(TS3)* 9(NC)* 10(NC)* 14(NC)* 15(NC)*; U3 9(CTS#)* 10(DSR#)* 11(RI#)* 12(DCD#)* 15(RS232)*; U4 1(GPO)* 2(CP)* 3(INDET1)* 4(PGGATE/DITHER)* 5(INDET2)* 6(ACIN)* 11(INT)* 14(DP)* 15(DM)* 16(FB)* 22(NC)*

### Layout directives
net class POWER: 5V, (no net found under the mark), AGND, BAT1+, BAT3+, BAT+, SW, VBUS, VIN_DC, VOUT
differential pair; differential pair class D: D_N, D_P

### Notes on the sheet
- SC8813 60W充电
- CH340带自动下载
- (near TYPEC1) TC1-USB
- TC2-PD快充诱骗20V
- SWD
- (near IC1) INA226/INA139
- DC输入
- BUCK-BOOST
- ADDR:0X80(写)  0X81(读)  10000000(写)  10000001(读)
- 低电平工作
- (near B2) ADDR:0XD0(写)0XD1(读)   11010000(写) 11010001 (读)
- (near U1) MCU
- ADDR:0X74(写)0X75(读)   01111000(写)  01111001(读)
- (near IC10) ADDR:0XA0(写)0XA1(读)   10100000(写)  10100001(读)
- LTC3780 10A MAX
- (near C23) PG开漏，上拉
- 软起动
- (near IC2) 电流检测
- (near IC2) 外部INTVCC输出
- 1.FCB  ->通过2202电阻接地
- (near R24) 强制连续模式
- (near R24) 工作频率
- (near IC2) 小于1.5关闭
- (near IC2) PGND靠近下端源极
- 肖特基二极管
- 电压反馈
- (near JP3) 连接器
- (near R27) DC-DC 5V 2A
- 恒流控制（待测试）
- 风扇
- 8254AA锂电池管理
- HY2213锂电池平衡 50mA平衡电流
- (near V1) LDO 3V3 0.8A
- 10mR 10A满量程是 100mv 放大30倍为3V
- 30V满量程分压是3V
- LDO 3V3 0.5A MCU
- 电压检测
- Title
- Size:
- Date:
- File:
- A1
- Number:
- Time:
- Revision:
- Sheet
- of
- (in symbol C-CAP) +
- (in symbol IRF7473) 5, 6, 7, 8; 1, 2, 3
- (in symbol LM358, part A) A
- (in symbol LM358, part B) B
- (in symbol 电池盒) 18650三串

### Library data of the parts
BAT_TEMP NTC1 NTC2 R1-R74 = R: 贴片电阻; 版权归属: 源创客; BOM名称: 贴片电阻; 学习资源: www.ooocke.com
C1-C57 EK1-EK4 = C: 无极性贴片电容; 版权归属: 源创客; BOM名称: 无极性贴片电容; 学习资源: www.ooocke.com
CON1 = DC-005P: 带屏蔽DC电源接口; 版权归属: 源创客; BOM名称: 带屏蔽DC电源接口; 学习资源: www.ooocke.com
D1-D6 = 1N4007: 整流二极管; 版权归属: 源创客; BOM名称: 整流二极管; 学习资源: www.ooocke.com
D7 = M7: 整流二极管; 版权归属: 源创客; BOM名称: 整流二极管; 学习资源: www.ooocke.com
D8 D9 = 1N4148: 高速开关二极管; 版权归属: 源创客; BOM名称: 高速开关二极管; 学习资源: www.ooocke.com
D10 D11 = SBR10U45SP5-13: Schottky Diode; Manufacturer_Name: Diodes Inc.; Datasheet Link: https://www.diodes.com/assets/Datasheets/SBR10U45SP5.pdf; Manufacturer_Part_Number: SBR10U45SP5-13; Mouser Part Number: 621-SBR10U45SP5-13; Mouser Price/Stock: https://www.mouser.co.uk/ProductDetail/Diodes-Incorporated/SBR10U45SP5-13/?qs=oUsD4qhOtFzkwQR1w2y69g%3D%3D; Arrow Part Number: SBR10U45SP5-13; Arrow Price/Stock: https://www.arrow.com/en/products/sbr10u45sp5-13/diodes-incorporated
DAC_I DAC_V SCL SDA U1R U1T U3R U3T = TEST: 测试点; 版权归属: 源创客; BOM名称: 测试点; 学习资源: www.ooocke.com
DZ1 DZ2 = 1N4106: 12V/0.5W稳压管; 版权归属: 源创客; BOM名称: 12V/0.5W稳压管; 学习资源: www.ooocke.com
E1-E9 = C-CAP: 直插电解电容; 版权归属: 源创客; BOM名称: 直插电解电容; 学习资源: www.ooocke.com
FAN = Header 2: 2P接插件; 版权归属: 源创客; BOM名称: 2P接插件; 学习资源: www.ooocke.com
IC1 = INA226AIDGST: Integrated Circuit; Manufacturer_Name: Texas Instruments; Datasheet Link: http://www.ti.com/lit/gpn/ina226; Height: 1.1mm; Manufacturer_Part_Number: INA226AIDGST; Mouser Part Number: 595-INA226AIDGST; Mouser Price/Stock: https://www.mouser.co.uk/ProductDetail/Texas-Instruments/INA226AIDGST?qs=tQG3bEuiOZB3Ay2BJOjnEQ%3D%3D; Arrow Part Number: INA226AIDGST; Arrow Price/Stock: https://www.arrow.com/en/products/ina226aidgst/texas-instruments
IC2 = LTC3780EG#TRPBF: Integrated Circuit; Manufacturer_Name: Analog Devices; Datasheet Link: https://www.arrow.com/en/products/ltc3780egtrpbf/analog-devices; Height: 2mm; Manufacturer_Part_Number: LTC3780EG#TRPBF; Mouser Part Number: 584-LTC3780EG#TRPBF; Mouser Price/Stock: https://www.mouser.co.uk/ProductDetail/Analog-Devices/LTC3780EGTRPBF/?qs=hVkxg5c3xu%252B2zWuQ0UDI2Q%3D%3D; Arrow Part Number: LTC3780EG#TRPBF; Arrow Price/Stock: https://www.arrow.com/en/products/ltc3780egtrpbf/analog-devices
IC3 = XL1509-5.0E1: Integrated Circuit; Manufacturer_Name: XLSEMI; Datasheet Link: https://datasheet.lcsc.com/szlcsc/XLSEMI-XL1509-5-0E1_C61063.pdf; Height: 1.75mm; Manufacturer_Part_Number: XL1509-5.0E1
IC4 = LM358: 双路运放; 版权归属: 源创客; BOM名称: 双路运放; 学习资源: www.ooocke.com
IC5 IC7 IC8 = HY2213-BB3A: Integrated Circuit; Manufacturer_Name: Hycon; Datasheet Link: https://datasheet.lcsc.com/szlcsc/HYCON-Tech-HY2213-BB3A_C113632.pdf; Height: 1.4mm; Manufacturer_Part_Number: HY2213-BB3A
IC6 = S-8254AAKFT-TB-U: Integrated Circuit; Manufacturer_Name: ABLIC U.S.A. Inc.; Datasheet Link: https://www.ablic.com/en/doc/datasheet/battery_protection/S8254A_E.pdf; Height: 1.1mm; Manufacturer_Part_Number: S-8254AAKFT-TB-U; Mouser Part Number: 628-S-8254AAKFT-TB-G; Mouser Price/Stock: https://www.mouser.com/Search/Refine.aspx?Keyword=628-S-8254AAKFT-TB-G
IC9 = DS1307Z: Integrated Circuit; Manufacturer_Name: Maxim Integrated; Datasheet Link: https://datasheets.maximintegrated.com/en/ds/DS1307.pdf; Height: 1.75mm; Manufacturer_Part_Number: DS1307Z; Mouser Part Number: 700-DS1307Z-NR; Mouser Price/Stock: https://www.mouser.co.uk/ProductDetail/Maxim-Integrated/DS1307Z/?qs=1eQvB6Dk1vjw3IRIE9TdIQ%3D%3D
IC10 = 24Cxx: 外置EEPROM; 版权归属: 源创客; BOM名称: 外置EEPROM; 学习资源: www.ooocke.com
IC11 = W25Qxx: 外置Flash; 版权归属: 源创客; BOM名称: 外置Flash; 学习资源: www.ooocke.com
JP2 = Header 4: 4P接插件; 版权归属: 源创客; BOM名称: 4P接插件; 学习资源: www.ooocke.com
JP3 = Header 18X2: 18*2P接插件; 版权归属: 源创客; BOM名称: 18*2P接插件; 学习资源: www.ooocke.com
L1 L3 = L-CDRH: 功率屏蔽电感; 版权归属: 源创客; BOM名称: 功率屏蔽电感; 学习资源: www.ooocke.com
L2 L4 = L: 小功率贴片电感; 版权归属: 源创客; BOM名称: 小功率贴片电感; 学习资源: www.ooocke.com
Q1 Q4 Q7-Q10 = IRF7473: HEXFET Power MOSFET; Published: 17-Sep-2003; LatestRevisionDate: 13-Apr-2006; LatestRevisionNote: IPC-7351 Footprint Added.; DatasheetVersion: 27-Apr-2001; PackageVersion: Feb-2001; PackageReference: SO-8; Publisher: Altium Limited; PackageDescription: 8-Pin Plastic Small Outline Integrated Circuit 1.27 mm Pitch; Code_JEDEC: MS-012-AA; Code_IPC: SOIC127P600-8; ComponentLink1Description: Manufacturer Link; ComponentLink1URL: http://www.irf.com/; ComponentLink2Description: Datasheet; ComponentLink2URL: http://www.irf.com/product-info/datasheets/data/irf7473.pdf
Q2 Q11 Q12 Q17 Q18 = D15P05: P沟道场效应管; 版权归属: 源创客; BOM名称: P沟道场效应管; 学习资源: www.ooocke.com
Q3 Q6 Q19 Q20 = 8050-SMD: 高频放大-NPN型; 版权归属: 源创客; 属性: 40V 1.5A 1W 100MHZ; BOM名称: 高频放大-NPN型; 学习资源: www.ooocke.com
Q5 = 8550-SMD: 高频放大-PNP型; 版权归属: 源创客; 属性: 40V 1.5A 1W 100MHZ; BOM名称: 高频放大-PNP型; 学习资源: www.ooocke.com
Q13-Q16 = SI2302: MOSFET (N-Channel); Manufacturer_Name: Micro Commercial Components (MCC); Datasheet Link: https://mouser.componentsearchengine.com/Datasheets/1/SI2302.pdf; Height: 1.005mm; Manufacturer_Part_Number: SI2302; Mouser Part Number: 833-SI2302; Mouser Price/Stock: https://www.mouser.co.uk/ProductDetail/Micro-Commercial-Components-MCC/SI2302?qs=6W4OQKoqJ0s%2FjuQxID9btg%3D%3D
RF1 = PPTC: PPTC自恢复保险丝; 版权归属: 源创客; BOM名称: PPTC自恢复保险丝; 学习资源: www.ooocke.com
TYPEC1 TYPEC2 = TYPEC: TPYEC接口 12PIN 的
U1 = STM32F103RE: 32位STM单片机; 版权归属: 源创客; BOM名称: 32位STM单片机; 学习资源: www.ooocke.com
U3 = CH340G: 串口转USB; 版权归属: 源创客; BOM名称: 串口转USB; 学习资源: www.ooocke.com
U5 = SGM8551XN: 轨到轨运算放大器
U6 = RT9193: LDO降压芯片
V1 = AMS1117: 三端稳压芯片; BOM名称: 稳压芯片; 版权归属: 源创客; 学习资源: www.ooocke.com
X1-X3 = XTAL-2P: 2脚无源脚晶振; 版权归属: 源创客; BOM名称: 2脚无源脚晶振; 学习资源: www.ooocke.com